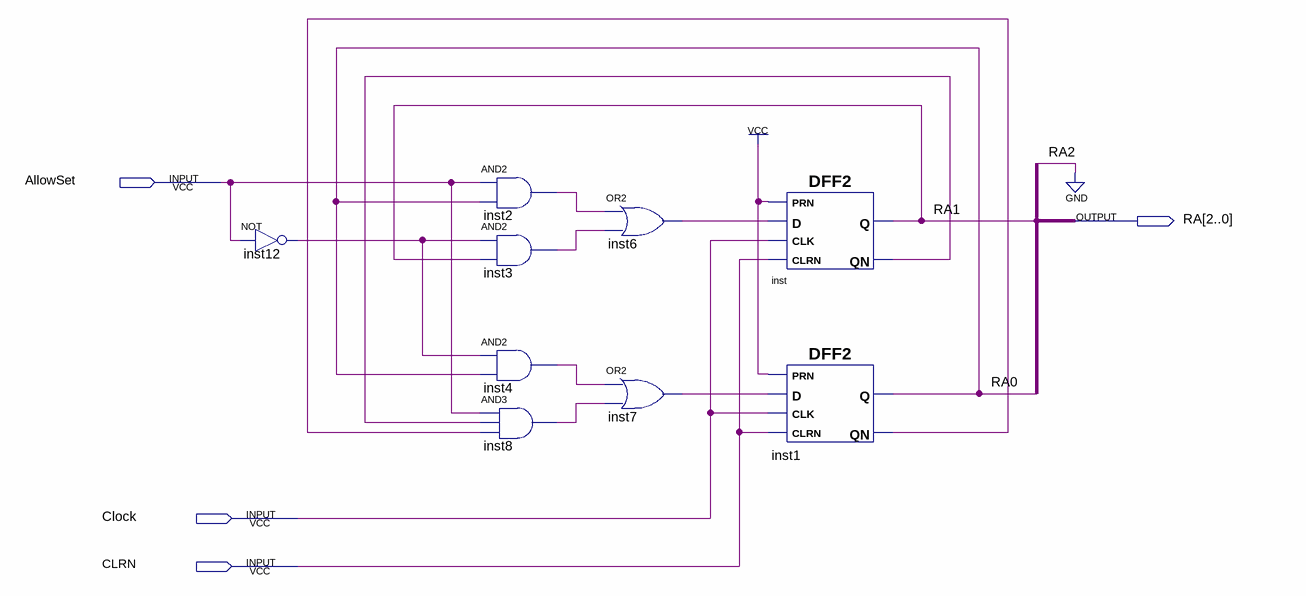
[diagram p0: schematic sheet]
// Quartus schematic readFSM.bdf as structural Verilog: 9 symbols, 4 pins
module readFSM (
  input  AllowSet,
  input  Clock,
  input  CLRN,
  output [2:0] RA
);

  wire inst1_qn, inst2_out, inst3_out, inst4_out, inst6_out, inst7_out, inst8_out, inst12_out, inst_qn;

  not inst12 (inst12_out, AllowSet);
  and inst2 (inst2_out, AllowSet, RA[0]);
  and inst3 (inst3_out, inst12_out, RA[1]);
  and inst4 (inst4_out, inst12_out, RA[0]);
  and inst8 (inst8_out, AllowSet, inst_qn, inst1_qn);
  or inst6 (inst6_out, inst2_out, inst3_out);
  or inst7 (inst7_out, inst4_out, inst8_out);
  DFF2 inst (.CLK(Clock), .D(inst6_out), .PRN(1'b1), .CLRN(CLRN), .Q(RA[1]), .QN(inst_qn));
  DFF2 inst1 (.CLK(Clock), .D(inst7_out), .PRN(1'b1), .CLRN(CLRN), .Q(RA[0]), .QN(inst1_qn));

  assign RA[2] = 1'b0;
endmodule
